# Altium schematic sheet buttons.SchDoc: Buttons
size B; Engineer: Jacob Faucett; Organization: CUAir; Address1: L3, 12a Rodborough Rd; Address2: Frenchs Forest; Address3: NSW; Address4: Australia 2086; Revision: 1; SheetNumber: 9; SheetTotal: 9; CompetitionYear: 2025; CPN: N/A; PROJECT: Current Logging and Validation Board
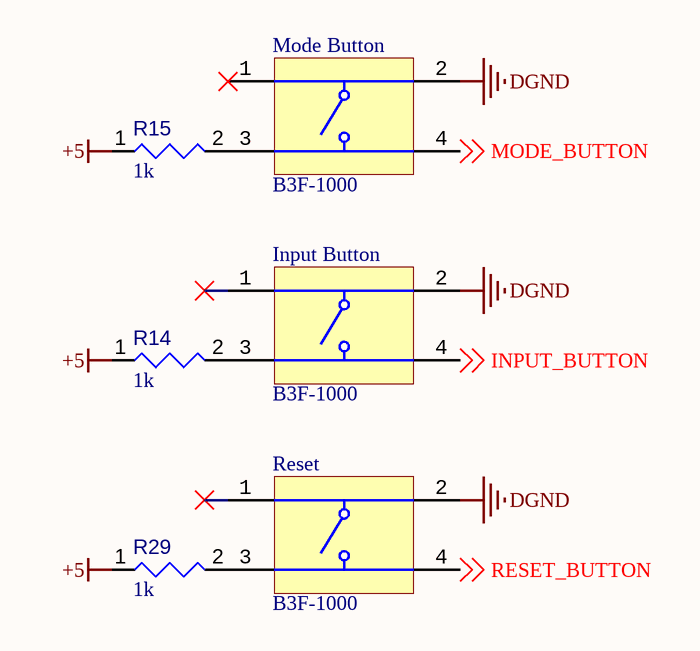
[diagram p0: buttons.SchDoc]

## Parts
Input_Button  B3F-1000  [OMRON-B3F-1000-4_V]
Mode_Button  B3F-1000  [OMRON-B3F-1000-4_V]
R14  value 1k  [RESC0402(1005)_L]  (hidden comment: Resistor 1K +/-5 % 0402 63 mW)
R15  value 1k  [RESC0402(1005)_L]  (hidden comment: Resistor 1K +/-5 % 0402 63 mW)
R29  value 1k  [RESC0402(1005)_L]  (hidden comment: Resistor 1K +/-5 % 0402 63 mW)
Reset  B3F-1000  [OMRON-B3F-1000-4_V]

## Nets
+5: R14.1 R15.1 R29.1
DGND: Input_Button.2 Mode_Button.2 Reset.2
INPUT_BUTTON: Input_Button.4 ; off-sheet INPUT_BUTTON
MODE_BUTTON: Mode_Button.4 ; off-sheet MODE_BUTTON
RESET_BUTTON: Reset.4 ; off-sheet RESET_BUTTON
NetInput_Button_3: Input_Button.3 R14.2
NetMode_Button_3: Mode_Button.3 R15.2
NetR29_2: R29.2 Reset.3

Not connected (* = marked no-connect by the designer): Input_Button 1*; Mode_Button 1*; Reset 1*

## Notes on the sheet
- Project
- Title
- Size:
- Date:
- B
- Number:
- Revision:
- File:

## Library data of the parts
Input_Button Mode_Button Reset = CMP-011-00004-2: Tactile Switch, SPST-NO, 0.05 A, 24 V, -25 to 70 degC, 4-Pin THD, RoHS, Bulk; Manufacturer: Omron Electronic Components; Throw Configuration: SPST; Max Contact Resistance: 100mohm; Resistance: 0.1Ohm; Max Current Rating: 50mA; Voltage Rating: 24V; Operating Force: 100gf; Datasheet Version: Jan-15; Case/Package: B3F-1000; Packaging: Bulk; Package Description: 4-Pin Through Hole Device, Body 6 x 6 mm; Manufacturer URL: http://www.omron.com/; Package Reference: B3F-1000; Contact Plating: Gold; Contact Current Rating: 50mA; RoHS Compliant: True; Contact Material: Gold; Mounting Technology: TH; Max Operating Temperature: 70°C; Min Operating Temperature: -25°C; Package Quantity: 1500; Datasheet URL: http://www.omron.com/ecb/products/pdf/en-b3f.pdf; Voltage Rating (DC): 24V; Pins: 4; Current Rating: 50mA; Max Voltage Rating (DC): 24V
R14 R15 R29 = CMP-009-00157-3: Chip Resistor, 1 kOhms, +/-5 %, 63 mW, -55 to 155 degC, 0402; Tolerance: 5%; Power: 63mW; Case/Package: 0402; Pins: 2; Min Operating Temperature: -55°C; Max Operating Temperature: 155°C